# Altium schematic sheet Digital Port L State LED Inducator.SchDoc: PORT State LED Inducator
size A3
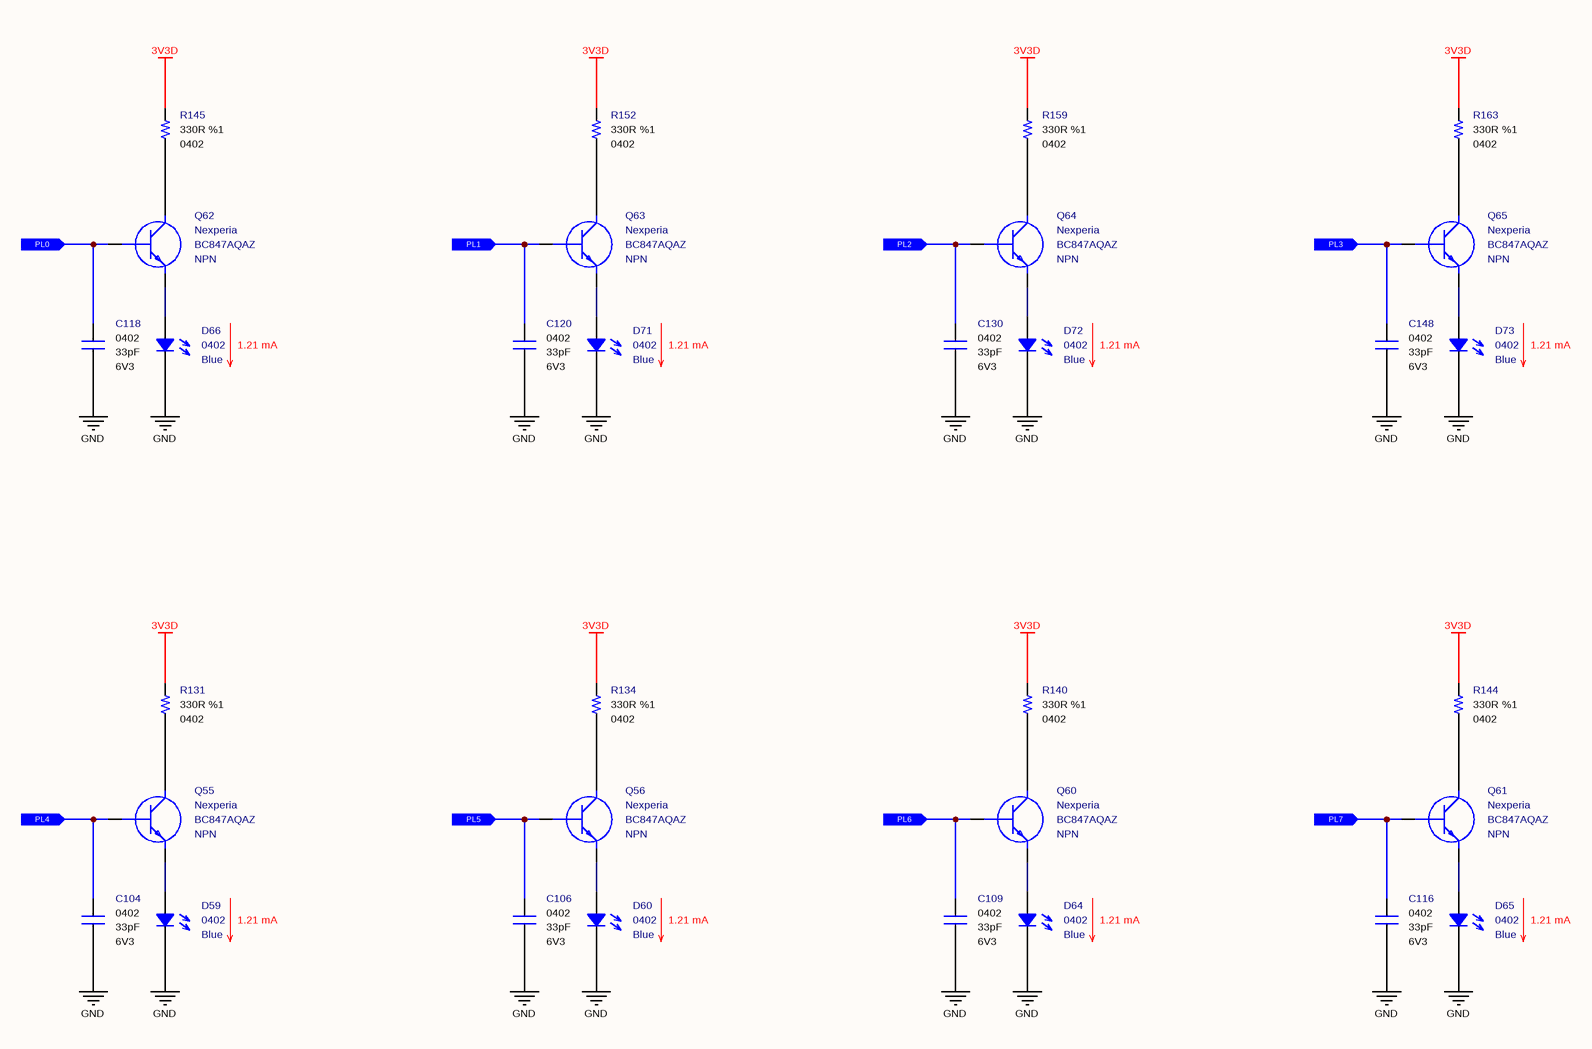
[diagram p0: Digital Port L State LED Inducator.SchDoc]

## Parts
C104  value 33pF  Case: 0402  Voltage: 6V3  [CAPACITOR_0402]  (hidden comment: Multilayer Ceramic Capacitor)
C106  value 33pF  Case: 0402  Voltage: 6V3  [CAPACITOR_0402]  (hidden comment: Multilayer Ceramic Capacitor)
C109  value 33pF  Case: 0402  Voltage: 6V3  [CAPACITOR_0402]  (hidden comment: Multilayer Ceramic Capacitor)
C116  value 33pF  Case: 0402  Voltage: 6V3  [CAPACITOR_0402]  (hidden comment: Multilayer Ceramic Capacitor)
C118  value 33pF  Case: 0402  Voltage: 6V3  [CAPACITOR_0402]  (hidden comment: Multilayer Ceramic Capacitor)
C120  value 33pF  Case: 0402  Voltage: 6V3  [CAPACITOR_0402]  (hidden comment: Multilayer Ceramic Capacitor)
C130  value 33pF  Case: 0402  Voltage: 6V3  [CAPACITOR_0402]  (hidden comment: Multilayer Ceramic Capacitor)
C148  value 33pF  Case: 0402  Voltage: 6V3  [CAPACITOR_0402]  (hidden comment: Multilayer Ceramic Capacitor)
D59  Case: 0402  Color: Blue  [LED_0402]  (hidden comment: SMD LED (Blue))
D60  Case: 0402  Color: Blue  [LED_0402]  (hidden comment: SMD LED (Blue))
D64  Case: 0402  Color: Blue  [LED_0402]  (hidden comment: SMD LED (Blue))
D65  Case: 0402  Color: Blue  [LED_0402]  (hidden comment: SMD LED (Blue))
D66  Case: 0402  Color: Blue  [LED_0402]  (hidden comment: SMD LED (Blue))
D71  Case: 0402  Color: Blue  [LED_0402]  (hidden comment: SMD LED (Blue))
D72  Case: 0402  Color: Blue  [LED_0402]  (hidden comment: SMD LED (Blue))
D73  Case: 0402  Color: Blue  [LED_0402]  (hidden comment: SMD LED (Blue))
Q55  Manufacturer_Name: Nexperia  Manufacturer_Part_Number: BC847AQAZ  Polarity: NPN  [SOT1215]  (hidden comment: Bipolar NPN Transistors)
Q56  Manufacturer_Name: Nexperia  Manufacturer_Part_Number: BC847AQAZ  Polarity: NPN  [SOT1215]  (hidden comment: Bipolar NPN Transistors)
Q60  Manufacturer_Name: Nexperia  Manufacturer_Part_Number: BC847AQAZ  Polarity: NPN  [SOT1215]  (hidden comment: Bipolar NPN Transistors)
Q61  Manufacturer_Name: Nexperia  Manufacturer_Part_Number: BC847AQAZ  Polarity: NPN  [SOT1215]  (hidden comment: Bipolar NPN Transistors)
Q62  Manufacturer_Name: Nexperia  Manufacturer_Part_Number: BC847AQAZ  Polarity: NPN  [SOT1215]  (hidden comment: Bipolar NPN Transistors)
Q63  Manufacturer_Name: Nexperia  Manufacturer_Part_Number: BC847AQAZ  Polarity: NPN  [SOT1215]  (hidden comment: Bipolar NPN Transistors)
Q64  Manufacturer_Name: Nexperia  Manufacturer_Part_Number: BC847AQAZ  Polarity: NPN  [SOT1215]  (hidden comment: Bipolar NPN Transistors)
Q65  Manufacturer_Name: Nexperia  Manufacturer_Part_Number: BC847AQAZ  Polarity: NPN  [SOT1215]  (hidden comment: Bipolar NPN Transistors)
R131  value 330R  Tolerance: %1  Case: 0402  [RESISTOR_0402]  (hidden comment: Thick Film Resistor)
R134  value 330R  Tolerance: %1  Case: 0402  [RESISTOR_0402]  (hidden comment: Thick Film Resistor)
R140  value 330R  Tolerance: %1  Case: 0402  [RESISTOR_0402]  (hidden comment: Thick Film Resistor)
R144  value 330R  Tolerance: %1  Case: 0402  [RESISTOR_0402]  (hidden comment: Thick Film Resistor)
R145  value 330R  Tolerance: %1  Case: 0402  [RESISTOR_0402]  (hidden comment: Thick Film Resistor)
R152  value 330R  Tolerance: %1  Case: 0402  [RESISTOR_0402]  (hidden comment: Thick Film Resistor)
R159  value 330R  Tolerance: %1  Case: 0402  [RESISTOR_0402]  (hidden comment: Thick Film Resistor)
R163  value 330R  Tolerance: %1  Case: 0402  [RESISTOR_0402]  (hidden comment: Thick Film Resistor)

## Ports
PL0 (in), PL1 (in), PL2 (in), PL3 (in), PL4 (in), PL5 (in), PL6 (in), PL7 (in)

## Nets
3V3D: R131.2 R134.2 R140.2 R144.2 R145.2 R152.2 R159.2 R163.2
GND: C104.2 C106.2 C109.2 C116.2 C118.2 C120.2 C130.2 C148.2 D59.1 D60.1 D64.1 D65.1 D66.1 D71.1 D72.1 D73.1
PL0: C118.1 Q62.1(B) ; port PL0
PL1: C120.1 Q63.1(B) ; port PL1
PL2: C130.1 Q64.1(B) ; port PL2
PL3: C148.1 Q65.1(B) ; port PL3
PL4: C104.1 Q55.1(B) ; port PL4
PL5: C106.1 Q56.1(B) ; port PL5
PL6: C109.1 Q60.1(B) ; port PL6
PL7: C116.1 Q61.1(B) ; port PL7
NetD59_2: D59.2 Q55.2(E)
NetD60_2: D60.2 Q56.2(E)
NetD64_2: D64.2 Q60.2(E)
NetD65_2: D65.2 Q61.2(E)
NetD66_2: D66.2 Q62.2(E)
NetD71_2: D71.2 Q63.2(E)
NetD72_2: D72.2 Q64.2(E)
NetD73_2: D73.2 Q65.2(E)
NetQ55_3: Q55.3(C) R131.1
NetQ56_3: Q56.3(C) R134.1
NetQ60_3: Q60.3(C) R140.1
NetQ61_3: Q61.3(C) R144.1
NetQ62_3: Q62.3(C) R145.1
NetQ63_3: Q63.3(C) R152.1
NetQ64_3: Q64.3(C) R159.1
NetQ65_3: Q65.3(C) R163.1

## Notes on the sheet
- 1.21 mA
- Title
- Size:
- Date:
- A3
- Number:
- Time:
- Revision:
- Sheet
- of
- File:

## Library data of the parts
C104 C106 C109 C116 C118 C120 C130 C148 = Capacitor - 33pF [0402-6V3]: Capacitor - 33pF [0402] (Ceramic); Manufacturer Name: Kemet; Manufacturer Part Number: C0402C330J9RACAUTO; Dielectric: X7R; Tolerance: 10%; Height: 0.5mm; Maximum Operating Temperature: +125; Minimum Operating Temperature: -55; ROHS: Yes; ComponentLink1Description: DataSheet; ComponentLink1URL: https://api.kemet.com/component-edge/download/datasheet/C0402C330J9RACAUTO.pdf; ComponentLink2Description: Mouser; ComponentLink2URL: https://www.mouser.com/Search/Refine.aspx?Keyword=80-C0402C330J9RAUTO; Supplier 1: Mouser; Supplier Part Number 1: 80-C0402C330J9RAUTO; Mouser Part Number: 80-C0402C330J9RAUTO
D59 D60 D64-D66 D71-D73 = Diode - LED (0402-Blue): Standard LEDs - SMD PICOLEDTM;BLUE LED; 25M @ 5MA; Manufacturer_Name: ROHM Semiconductor; Manufacturer_Part_Number: SMLP13BC8TT86; Mouser_Part_Number: 755-SMLP13BC8TT86; ROHS: Yes; ComponentLink1Description: DataSheet; ComponentLink1URL: https://d1d2qsbl8m0m72.cloudfront.net/en/products/databook/datasheet/opto/led/chip_mono/sml-p1-e.pdf; ComponentLink2Description: Mouser; ComponentLink2URL: https://www.mouser.com.tr/ProductDetail/ROHM-Semiconductor/SMLP13BC8TT86?qs=%2Fha2pyFaduidYDgXFKL%252BNZwCVZNUI4FlyPWWbVDx1b6ABmzS%252BS2f0w%3D%3D; Supplier 1: Mouser; Supplier 2: Digi-Key; Supplier Part Number 1: 755-SMLP13BC8TT86; Supplier Part Number 2: 846-1112-1-ND
Q55 Q56 Q60-Q65 = Transistor - BC847: Bipolar Transistors - BJT BC847AQA/DFN1010D-3/REEL 7" Q2; Mouser_Part_Number: 771-BC847AQAZ; ComponentLink1Description: DataSheet; ComponentLink1URL: https://www.mouser.com.tr/datasheet/2/916/BC847XQA_SER-1598405.pdf; ComponentLink2Description: Mouser; ComponentLink2URL: https://www.mouser.com.tr/ProductDetail/Nexperia/BC847AQAZ?qs=%2Fha2pyFaduhKMCPKNtQimeJpXTw9z4AqURd2YARs8DVICZNv3AT9Dw%3D%3D; Case: DFN-1010D-3; Supplier 1: Mouser; Supplier 2: Digi-Key; Supplier Part Number 1: 771-BC847AQAZ; Supplier Part Number 2: 1727-2545-1-ND
R131 R134 R140 R144 R145 R152 R159 R163 = Resistor - 330R: Thick Film Resistors - SMD 1/16 W 330 Ohm 1%; Manufacturer Name: Vishay; Manufacturer Part Number: CRCW0402330RFKED; Height: 0.4mm; ComponentLink1Description: DataSheet; ComponentLink1URL: https://www.mouser.com.tr/datasheet/2/427/dcrcwe3-1762152.pdf; ComponentLink2Description: Mouser; ComponentLink2URL: https://www.mouser.com.tr/ProductDetail/Vishay-Dale/CRCW0402330RFKED?qs=sGAEpiMZZMu61qfTUdNhG2DpbjADlD3GGS6SwBlLi5Q%3D; Supplier 1: Mouser; Supplier 2: Digi-Key; Supplier Part Number 2: 541-330LCT-ND; Supplier Part Number 1: 71-CRCW0402-330-E3; Mouser Part Number: 71-CRCW0402-330-E3